# Altium schematic sheet USB to UART controller.SchDoc
size A4; SheetNumber: 5; SheetTotal: 7
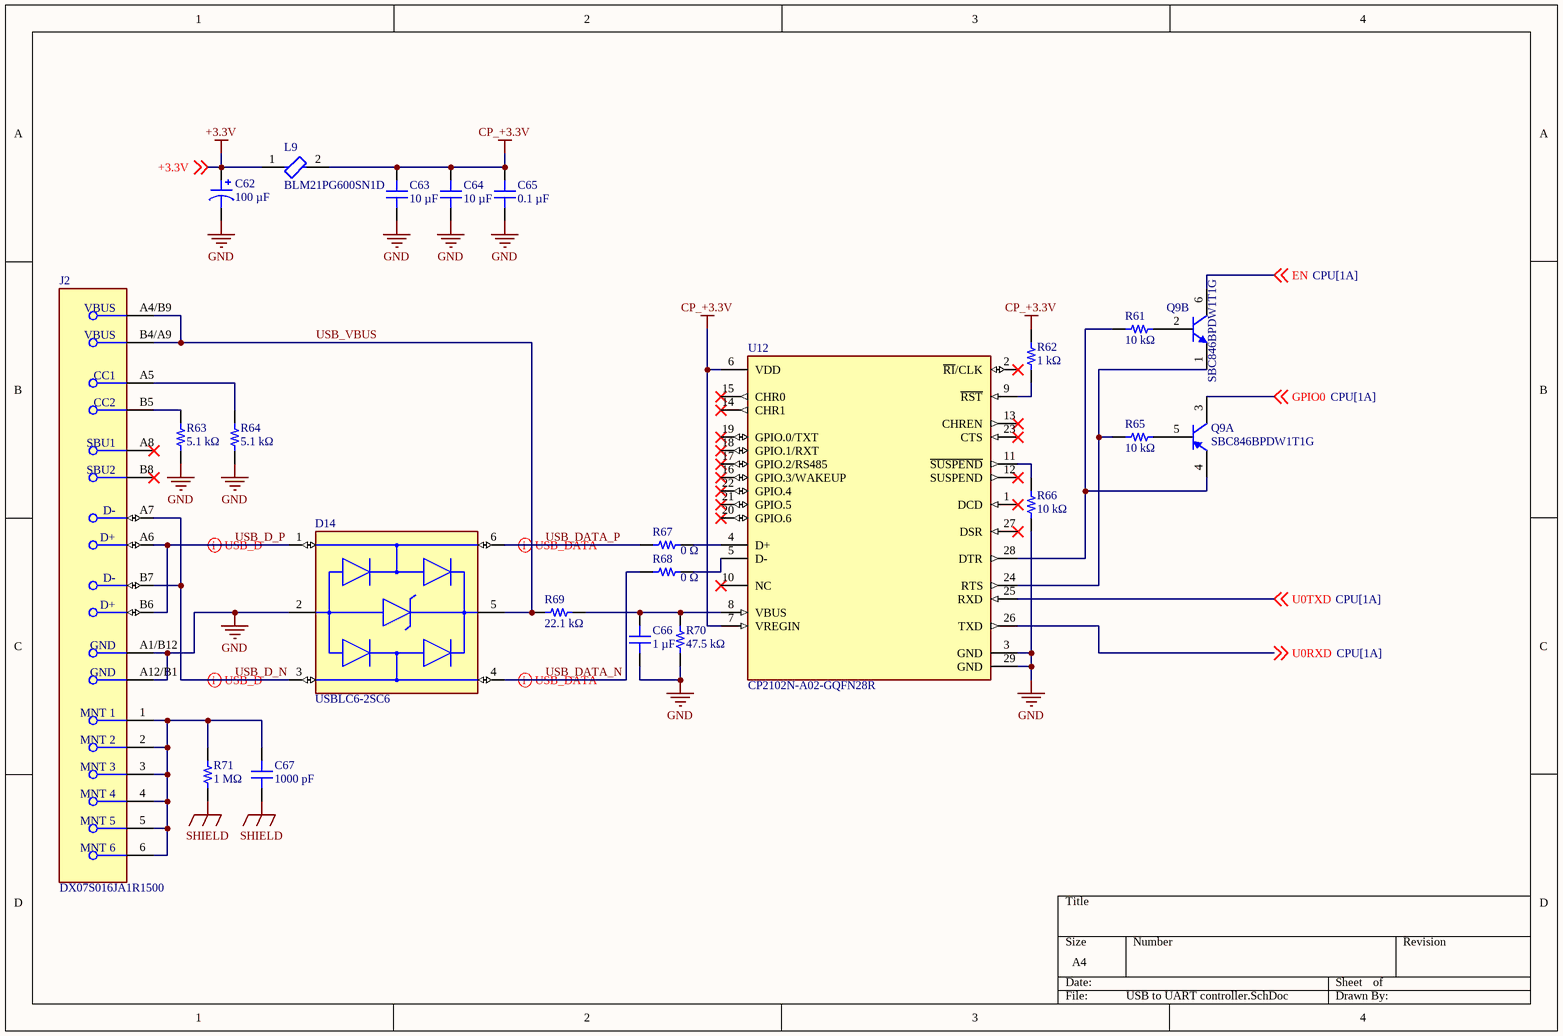
[diagram p0: USB to UART controller.SchDoc]

## Parts
C62  100 µF  [CAP POL 1411_3528]
C63  10 µF  [CAP 0805_2012]
C64  10 µF  [CAP 0805_2012]
C65  0.1 µF  [CAP 0603_1608]
C66  1 µF  [CAP 0805_2012]
C67  1000 pF  [CAP 1210_3225 - 1MM]
D14  USBLC6-2SC6  [FP-SOT-666-MFG]
J2  DX07S016JA1R1500  [FP-DX07S016JA1R1500-MFG]
L9  BLM21PG600SN1D  [FP-BLM21-0_2-t0_85-e0_5-d-IPC_A]
Q9  SBC846BPDW1T1G  [ONSC-SOT-363-6-419B-02_V]  (parts A,B of 2)
R61  10 kΩ  [RES 0603_1608]
R62  1 kΩ  [RES 0603_1608]
R63  5.1 kΩ  [RES 0603_1608]
R64  5.1 kΩ  [RES 0603_1608]
R65  10 kΩ  [RES 0603_1608]
R66  10 kΩ  [RES 0603_1608]
R67  0 Ω  [RES 0603_1608]
R68  0 Ω  [RES 0603_1608]
R69  22.1 kΩ  [RES 0603_1608]
R70  47.5 kΩ  [RES 0603_1608]
R71  1 MΩ  [RES 0805_2012]
U12  CP2102N-A02-GQFN28R  [FP-CP2102N-A02-GQFN28R-MFG]

## Nets
+3.3V: C62.1 L9.1 ; off-sheet +3.3V
CP_+3.3V: C63.2 C64.2 C65.2 L9.2 R62.2 U12.6(VDD) U12.7(VREGIN)
GND: C62.2 C63.1 C64.1 C65.1 C66.1 D14.2(GND) J2.A1/B12(GND) J2.A12/B1(GND) R63.1 R64.1 R66.1 R70.1 U12.3(GND) U12.29(GND)
SHIELD: C67.1 R71.1
EN: Q9.6(C) ; off-sheet EN
GPIO0: Q9.3(C) ; off-sheet GPIO0
U0RXD: U12.26(TXD) ; off-sheet U0RXD
U0TXD: U12.25(RXD) ; off-sheet U0TXD
USB_D_N: D14.3(I/O2) J2.A7(D-) J2.B7(D-)
USB_D_P: D14.1(I/O1) J2.A6(D+) J2.B6(D+)
USB_DATA_N: D14.4(I/O2) R68.1
USB_DATA_P: D14.6(I/O1) R67.1
USB_VBUS: D14.5(VBUS) J2.A4/B9(VBUS) J2.B4/A9(VBUS) R69.2
NetC66_2: C66.2 R69.1 R70.2 U12.8(VBUS)
NetC67_2: C67.2 J2.1(MNT_1) J2.2(MNT_2) J2.3(MNT_3) J2.4(MNT_4) J2.5(MNT_5) J2.6(MNT_6) R71.2
NetJ2_A5: J2.A5(CC1) R64.2
NetJ2_B5: J2.B5(CC2) R63.2
NetQ9_1: Q9.1(E) R65.2 U12.24(RTS)
NetQ9_2: Q9.2(B) R61.1
NetQ9_4: Q9.4(E) R61.2 U12.28(DTR)
NetQ9_5: Q9.5(B) R65.1
NetR62_1: R62.1 U12.9(~{RST})
NetR66_2: R66.2 U12.11(~{SUSPEND})
NetR67_2: R67.2 U12.4(D+)
NetR68_2: R68.2 U12.5(D-)

Not connected (* = marked no-connect by the designer): J2 A8(SBU1)* B8(SBU2)*; U12 1(DCD)* 2(~{RI}/CLK)* 10(NC)* 12(SUSPEND)* 13(CHREN)* 14(CHR1)* 15(CHR0)* 16(GPIO.3/WAKEUP)* 17(GPIO.2/RS485)* 18(GPIO.1/RXT)* 19(GPIO.0/TXT)* 20(GPIO.6)* 21(GPIO.5)* 22(GPIO.4)* 23(CTS)* 27(DSR)*

## Layout directives
differential pair: USB_D_N, USB_D_P, USB_DATA_N, USB_DATA_P

## Library data of the parts
C62 = T494B107M006AT: CAP TANT 100UF 20% 6.3V 1411; manufacturer: KEMET; Manufacturer Size Code: B; ESR (Equivalent Series Resistance): 1.5Ohm; Lifetime @ Temp.: 2000 Hrs @ 125°C; Type: Molded; Part Number: T494B107M006AT; Value: 100 µF; Capacitance: 100 µF; componentlink1description: Datasheet; componentlink1url: https://api.kemet.com/component-edge/download/datasheet/T494B107M006AT.pdf; componentlink2description: DigiKey Link; componentlink2url: https://www.digikey.com/en/products/detail/kemet/T494B107M006AT/818693; Device Package: 1411 (3528 Metric); Features: General Purpose; Height - Seated (Max): 0.083" (2.10mm); lastupdated: 3.06.2024 19:29:03; Lifecycle Status: Active; Minimum Order: 1; Mounting Type: Surface Mount; Operating Temperature: -55°C ~ 125°C; Package / Case: 1411 (3528 Metric); packaging: TapeAndReel; partid: 7; Part Status: Active; price: 0.49; series: T494; Size / Dimension: 0.138" L x 0.110" W (3.50mm x 2.80mm); Supplier 1: DigiKey; Supplier Part Number 1: 399-3833-1-ND; Tolerance: ±20%; Voltage - Rated: 6.3 V
C63 C64 = CGA4J1X7R0J106K125AC: CAP CER 10UF 6.3V X7R 0805; manufacturer: TDK Corporation; Tolerance: ±10%; Part Number: CGA4J1X7R0J106K125AC; Capacitance: 10 µF; Applications: Automotive; componentlink1description: Datasheet; componentlink1url: https://product.tdk.com/info/en/catalog/datasheets/mlcc_automotive_general_en.pdf?ref_disty=digikey; componentlink2description: DigiKey Link; componentlink2url: https://www.digikey.com/en/products/detail/tdk-corporation/CGA4J1X7R0J106K125AC/2672864; Device Package: 0805 (2012 Metric); lastupdated: 9.02.2024 20:16:07; Lifecycle Status: Active; Minimum Order: 1; Mounting Type: Surface Mount, MLCC; Operating Temperature: -55°C ~ 125°C; Package / Case: 0805 (2012 Metric); packaging: TapeAndReel; partid: 3016; Part Status: Active; price: 0.06; Ratings: AEC-Q200; series: CGA; Size / Dimension: 0.079" L x 0.049" W (2.00mm x 1.25mm); Supplier 1: DigiKey; Supplier Part Number 1: 445-6971-1-ND; Temperature Coefficient: X7R; Thickness (Max): 0.057" (1.45mm); value: 10 µF; Voltage - Rated: 6.3V
C65 = C1608X7R1H104K080AE: CAP CER 0.1UF 50V X7R 0603; manufacturer: TDK Corporation; Tolerance: ±10%; Part Number: C1608X7R1H104K080AE; Capacitance: 0.1 µF; Applications: Boardflex Sensitive; componentlink1description: Datasheet; componentlink1url: https://product.tdk.com/info/en/catalog/datasheets/mlcc_commercial_soft_en.pdf?ref_disty=digikey; componentlink2description: DigiKey Link; componentlink2url: https://www.digikey.com/en/products/detail/tdk-corporation/C1608X7R1H104K080AE/4490564; Device Package: 0603 (1608 Metric); Features: Soft Termination; lastupdated: 9.02.2024 20:10:17; Lifecycle Status: Active; Minimum Order: 1; Mounting Type: Surface Mount, MLCC; Operating Temperature: -55°C ~ 125°C; Package / Case: 0603 (1608 Metric); packaging: TapeAndReel; partid: 12789; Part Status: Active; price: 0.02; series: C; Size / Dimension: 0.063" L x 0.031" W (1.60mm x 0.80mm); Supplier 1: DigiKey; Supplier Part Number 1: 445-15927-6-ND; Temperature Coefficient: X7R; Thickness (Max): 0.037" (0.95mm); value: 0.1 µF; Voltage - Rated: 50V
C66 = C2012X7R1E105K125AB: CAP CER 1UF 25V X7R 0805; manufacturer: TDK Corporation; Tolerance: ±10%; Part Number: C2012X7R1E105K125AB; Capacitance: 1 µF; Applications: General Purpose; componentlink1description: Datasheet; componentlink1url: https://product.tdk.com/info/en/catalog/datasheets/mlcc_commercial_general_en.pdf?ref_disty=digikey; componentlink2description: DigiKey Link; componentlink2url: https://www.digikey.com/en/products/detail/tdk-corporation/C2012X7R1E105K125AB/513887; Device Package: 0805 (2012 Metric); Features: Low ESL; lastupdated: 9.02.2024 20:15:16; Lifecycle Status: Active; Minimum Order: 1; Mounting Type: Surface Mount, MLCC; Operating Temperature: -55°C ~ 125°C; Package / Case: 0805 (2012 Metric); packaging: TapeAndReel; partid: 33961; Part Status: Active; price: 0.03; series: C; Size / Dimension: 0.079" L x 0.049" W (2.00mm x 1.25mm); Supplier 1: DigiKey; Supplier Part Number 1: 445-1354-1-ND; Temperature Coefficient: X7R; Thickness (Max): 0.057" (1.45mm); value: 1 µF; Voltage - Rated: 25V
C67 = KGM32LCG3D102JU: CAP CER 1000PF 2KV C0G/NP0 1210; manufacturer: KYOCERA AVX; Temperature Coefficient: C0G, NP0; Tolerance: ±5%; Voltage - Rated: 2000V (2kV); Part Number: KGM32LCG3D102JU; Value: 1000 pF; Applications: General Purpose; Capacitance: 1000 pF; componentlink1description: Datasheet; componentlink1url: https://datasheets.kyocera-avx.com/HVKGM.pdf; componentlink2description: DigiKey Link; componentlink2url: https://www.digikey.com/en/products/detail/kyocera-avx/KGM32LCG3D102JU/11249117; Device Package: 1210 (3225 Metric); Features: High Voltage; lastupdated: 4.06.2024 19:20:42; Lifecycle Status: Active; Minimum Order: 1; Mounting Type: Surface Mount, MLCC; Operating Temperature: -55°C ~ 125°C; Package / Case: 1210 (3225 Metric); packaging: TapeAndReel; partid: 58470; price: 0.32; series: KGM - HV; Size / Dimension: 0.130" L x 0.098" W (3.30mm x 2.50mm); Supplier 1: DigiKey; Supplier Part Number 1: 478-KGM32LCG3D102JUCT-ND; Thickness (Max): 0.110" (2.80mm)
D14 = CMP-12225-000058-1: TVS DIODE 5.25V 17V SOT666; Manufacturer: STMicroelectronics; Min Breakdown Voltage: 6V; Power Line Protection: Yes; Element Configuration: Dual; Test Current: 1mA; Working Voltage: 5V; Number of Channels: 2; Max Reverse Leakage Current: 150nA; Direction: Unidirectional; Peak Pulse Current: 5A; Number of Elements: 1; Capacitance: 3.5pF; Value: 2.5pF; Data Rate: 480Mbps; Forward Voltage: 1.1V; Max Junction Temperature (Tj): 125°C; Max Breakdown Voltage: 6V; Height: 0.6mm; Depth: 1.3mm; Contact Plating: Tin; Reverse Breakdown Voltage: 6V; REACH SVHC: No SVHC; Operating Supply Voltage: 5V; Width: 1.3mm; Max Operating Temperature: 125°C; Reverse Standoff Voltage: 5V; ESD Protection: Yes; Package Quantity: 1; Termination: SMD/SMT; Length: 1.7mm; Leakage Current: 150nA; Number of Bidirectional Channels: 2; Case/Package: SOT-666; Min Operating Temperature: -40°C; Number of Pins: 6; Clamping Voltage: 17V; Breakdown Voltage: 6V; Lead Free: Lead Free; Radiation Hardening: No; Packaging: Tape and Reel; Mount: Surface Mount; Polarity: Unidirectional; Supplier: TME; Supplier Part Number: USBLC6-2SC6; Manufacturer Part Number: USBLC6-2SC6; RoHS: Compliant; Category: TVS Diodes; Stock: 48156; China RoHS: Compliant; Lifecycle Status: Production; Max Repetitive Reverse Voltage (Vrrm): 5.25V; Mounting Technology: Surface Mount; Pins: 6; Number of Terminals: 6; Peak Reverse Current: 150nA; Schedule B: 8536300000, 8536300000|8536300000|8536300000|8536300000|8536300000|8536300000|8536300000|8536300000|8536300000|8536300000|8536300000|8536300000|8536300000|8536300000|8536300000|8536300000|8536300000|8536300000|8536300000|8536300000|8536300000|8536300000|8536300000|85; ComponentLink1URL: https://datasheet.octopart.com:443/USBLC6-2SC6-STMicroelectronics-datasheet-10412581.pdf?src-supplier=Newark; ComponentLink1Description: https://datasheet.octopart.com:443/USBLC6-2SC6-STMicroelectronics-datasheet-10412581.pdf?src-supplier=Newark; ComponentLink2URL: https://datasheet.octopart.com:443/USBLC6-2SC6-STMicroelectronics-datasheet-181961833.pdf?src-supplier=Newark; ComponentLink2Description: https://datasheet.octopart.com:443/USBLC6-2SC6-STMicroelectronics-datasheet-181961833.pdf?src-supplier=Newark; ComponentLink3URL: https://datasheet.octopart.com:443/USBLC6-2SC6-STMicroelectronics-datasheet-525477.pdf?src-supplier=Factory+Futures; ComponentLink3Description: https://datasheet.octopart.com:443/USBLC6-2SC6-STMicroelectronics-datasheet-525477.pdf?src-supplier=Factory+Futures; ComponentLink4URL: https://datasheet.octopart.com:443/USBLC6-2SC6-STMicroelectronics-datasheet-82998616.pdf?src-supplier=Farnell; ComponentLink4Description: https://datasheet.octopart.com:443/USBLC6-2SC6-STMicroelectronics-datasheet-82998616.pdf?src-supplier=Farnell; ComponentLink5URL: https://datasheet.octopart.com:443/USBLC6-2SC6-STMicroelectronics-datasheet-46285.pdf?src-supplier=Farnell; ComponentLink5Description: https://datasheet.octopart.com:443/USBLC6-2SC6-STMicroelectronics-datasheet-46285.pdf?src-supplier=Farnell; ComponentLink6URL: https://datasheet.octopart.com:443/USBLC6-2SC6-STMicroelectronics-datasheet-14050643.pdf?src-supplier=iiiC; ComponentLink6Description: https://datasheet.octopart.com:443/USBLC6-2SC6-STMicroelectronics-datasheet-14050643.pdf?src-supplier=iiiC; ComponentLink7URL: https://datasheet.octopart.com:443/USBLC6-2SC6-STMicroelectronics-datasheet-10521292.pdf?src-supplier=Jameco; ComponentLink7Description: https://datasheet.octopart.com:443/USBLC6-2SC6-STMicroelectronics-datasheet-10521292.pdf?src-supplier=Jameco
J2 = CMP-19038-000003-1: CONN RCP USB2.0 TYP C 24P SMD RA
L9 = CMP-0686-00616-3: Chip Ferrite Bead, 0805, 60Ω @ 100MHz, 0.02Ω, 25%, 3.5A; DC Resistance-Max: 20mR; Number of Circuits: 1; Impedance: 60R; DC Current: 3A; Shielding: Unshielded; Material: Steel; Military Standard: Not; DC Resistance (DCR): 20mR; Core Material: Ferrite; Termination: SMD/SMT; Max Operating Temperature: 125°C; Max Current Rating: 3.5A; Length: 2mm; Packaging: Tape and Reel; Case Code (Metric): 2012; Series: BLM21P; REACH SVHC: No SVHC; Width: 1.25mm; Current Rating: 3.5A; Height: 0.85mm; RoHS Compliant: Yes; Case Code (Imperial): 0805; Radiation Hardening: No; Frequency: 100MHz; Package Quantity: 1; Depth: 1.25mm; Tolerance: 25%; Number of Lines: 1; Lead Free: Lead Free; Case/Package: 0805; Min Operating Temperature: -55°C; Max DC Current: 3A; Number of Pins: 2; Test Frequency: 100MHz
Q9 = CMP-1048-00842-1: Dual General Purpose Transistors, NPN / PNP (Complementary), 6-Pin SOT-363, Pb-Free, Tape and Reel; Manufacturer: On Semiconductor; IC Continuous (A): 0.1; fT Min (MHz): 100; ComponentLink2Description: Datasheet; RoHS: TRUE; ComponentLink2URL: http://www.onsemi.cn/pub_link/Collateral/BC846BPDW1T1-D.PDF; ComponentLink1Description: Manufacturer URL; ComponentLink1URL: http://www.onsemi.com/; Mounting Technology: Surface Mount; PackageVersion: Rev. Y, 12/2012; Packing: Tape and Reel; Polarity: Complementary; ComponentLink3URL: http://www.onsemi.cn/pub_link/Collateral/419B-02.PDF; DatasheetVersion: Rev. 9; PackageDescription: 6-Pin Small Outline Transistor, Body 2 x 1.25 mm, Pitch 0.65 mm; ComponentLink3Description: Package Specification; PartNumber: SBC846BPDW1T1G; PackageReference: SOT-363-6-419B-02
R61 R65 R66 = CRCW060310K0FKEA: RES SMD 10K OHM 1% 1/10W 0603; Manufacturer: Vishay Dale; Power (Watts): 0.1W, 1/10W; Resistance: 10 kOhms; Temperature Coefficient: ±100ppm/°C; Part Number: CRCW060310K0FKEA; Value: 10 kΩ; ComponentLink1Description: Datasheet; ComponentLink1URL: http://www.vishay.com/docs/20035/dcrcwe3.pdf; ComponentLink2Description: DigiKey Link; ComponentLink2URL: https://www.digikey.com/en/products/detail/vishay-dale/CRCW060310K0FKEA/1174782; Composition: Thick Film; Device Package: 0603 (1608 Metric); Features: Automotive AEC-Q200; Height - Seated (Max): 0.020" (0.50mm); LastUpdated: 9.02.2024 20:42:10; Lifecycle Status: Active; Minimum Order: 1; Number of Terminations: 2; Operating Temperature: -55°C ~ 155°C; Package / Case: 0603 (1608 Metric); Packaging: CutTape; PartId: 24636; Part Status: Active; Price: 0.01; Ratings: AEC-Q200; Series: CRCW; Size / Dimension: 0.061" L x 0.033" W (1.55mm x 0.85mm); Supplier 1: DigiKey; Supplier Part Number 1: 541-10.0KHCT-ND; Supplier Device Package: 0603; Tolerance: ±1%
R62 = CRCW06031K00FKEA: RES SMD 1K OHM 1% 1/10W 0603; Manufacturer: Vishay Dale; Power (Watts): 0.1W, 1/10W; Resistance: 1 kOhms; Temperature Coefficient: ±100ppm/°C; Part Number: CRCW06031K00FKEA; Value: 1 kΩ; ComponentLink1Description: Datasheet; ComponentLink1URL: http://www.vishay.com/docs/20035/dcrcwe3.pdf; ComponentLink2Description: DigiKey Link; ComponentLink2URL: https://www.digikey.com/en/products/detail/vishay-dale/CRCW06031K00FKEA/1174668; Composition: Thick Film; Device Package: 0603 (1608 Metric); Features: Automotive AEC-Q200; Height - Seated (Max): 0.020" (0.50mm); LastUpdated: 9.02.2024 20:42:10; Lifecycle Status: Active; Minimum Order: 1; Number of Terminations: 2; Operating Temperature: -55°C ~ 155°C; Package / Case: 0603 (1608 Metric); Packaging: CutTape; PartId: 24637; Part Status: Active; Price: 0.01; Ratings: AEC-Q200; Series: CRCW; Size / Dimension: 0.061" L x 0.033" W (1.55mm x 0.85mm); Supplier 1: DigiKey; Supplier Part Number 1: 541-1.00KHCT-ND; Supplier Device Package: 0603; Tolerance: ±1%
R63 R64 = CRCW06035K10FKEA: RES SMD 5.1K OHM 1% 1/10W 0603; Manufacturer: Vishay Dale; Power (Watts): 0.1W, 1/10W; Temperature Coefficient: ±100ppm/°C; Part Number: CRCW06035K10FKEA; Value: 5.1 kΩ; ComponentLink1Description: Datasheet; ComponentLink1URL: http://www.vishay.com/docs/20035/dcrcwe3.pdf; ComponentLink2Description: DigiKey Link; ComponentLink2URL: https://www.digikey.com/en/products/detail/vishay-dale/CRCW06035K10FKEA/1174748; Composition: Thick Film; Device Package: 0603 (1608 Metric); Features: Automotive AEC-Q200; Height - Seated (Max): 0.020" (0.50mm); LastUpdated: 9.02.2024 20:43:06; Lifecycle Status: Active; Minimum Order: 1; Number of Terminations: 2; Operating Temperature: -55°C ~ 155°C; Package / Case: 0603 (1608 Metric); Packaging: CutTape; PartId: 12590; Part Status: Active; Price: 0.01; Ratings: AEC-Q200; Resistance: 5.1 kΩ; Series: CRCW; Size / Dimension: 0.061" L x 0.033" W (1.55mm x 0.85mm); Supplier 1: DigiKey; Supplier Part Number 1: 541-5.10KHCT-ND; Supplier Device Package: 0603; Tolerance: ±1%
R67 R68 = ERJ-3GEY0R00V: RES SMD 0 OHM JUMPER 1/10W 0603; Manufacturer: Panasonic Electronic Components; Power (Watts): 0.1W, 1/10W; Part Number: ERJ-3GEY0R00V; Value: 0 Ω; ComponentLink1Description: Datasheet; ComponentLink1URL: http://industrial.panasonic.com/www-cgi/jvcr13pz.cgi?E+PZ+3+AOA0001+ERJ3GEY0R00V+7+WW; ComponentLink2Description: DigiKey Link; ComponentLink2URL: https://www.digikey.com/en/products/detail/panasonic-electronic-components/ERJ-3GEY0R00V/135656; Composition: Thick Film; Device Package: 0603 (1608 Metric); Features: Automotive AEC-Q200; Height - Seated (Max): 0.022" (0.55mm); LastUpdated: 9.02.2024 20:42:26; Lifecycle Status: Active; Minimum Order: 1; Number of Terminations: 2; Operating Temperature: -55°C ~ 155°C; Package / Case: 0603 (1608 Metric); Packaging: CutTape; PartId: 22603; Part Status: Active; Price: 0.01; Ratings: AEC-Q200; Resistance: 0 Ω; Series: ERJ-3G; Size / Dimension: 0.063" L x 0.031" W (1.60mm x 0.80mm); Supplier 1: DigiKey; Supplier Part Number 1: P0.0GCT-ND; Supplier Device Package: 0603; Tolerance: Jumper
R69 = CRCW060322K1FKEA: RES SMD 22.1K OHM 1% 1/10W 0603; Manufacturer: Vishay Dale; Power (Watts): 0.1W, 1/10W; Temperature Coefficient: ±100ppm/°C; Part Number: CRCW060322K1FKEA; Value: 22.1 kΩ; ComponentLink1Description: Datasheet; ComponentLink1URL: http://www.vishay.com/docs/20035/dcrcwe3.pdf; ComponentLink2Description: DigiKey Link; ComponentLink2URL: https://www.digikey.com/en/products/detail/vishay-dale/CRCW060322K1FKEA/1174819; Composition: Thick Film; Device Package: 0603 (1608 Metric); Features: Automotive AEC-Q200; Height - Seated (Max): 0.020" (0.50mm); LastUpdated: 9.02.2024 20:43:05; Lifecycle Status: Active; Minimum Order: 1; Number of Terminations: 2; Operating Temperature: -55°C ~ 155°C; Package / Case: 0603 (1608 Metric); Packaging: CutTape; PartId: 12700; Part Status: Active; Price: 0.01; Ratings: AEC-Q200; Resistance: 22.1 kΩ; Series: CRCW; Size / Dimension: 0.061" L x 0.033" W (1.55mm x 0.85mm); Supplier 1: DigiKey; Supplier Part Number 1: 541-22.1KHCT-ND; Supplier Device Package: 0603; Tolerance: ±1%
R70 = CRCW060347K5FKEA: RES SMD 47.5K OHM 1% 1/10W 0603; Manufacturer: Vishay Dale; Power (Watts): 0.1W, 1/10W; Temperature Coefficient: ±100ppm/°C; Part Number: CRCW060347K5FKEA; Value: 47.5 kΩ; ComponentLink1Description: Datasheet; ComponentLink1URL: http://www.vishay.com/docs/20035/dcrcwe3.pdf; ComponentLink2Description: DigiKey Link; ComponentLink2URL: https://www.digikey.com/en/products/detail/vishay-dale/CRCW060347K5FKEA/1174859; Composition: Thick Film; Device Package: 0603 (1608 Metric); Features: Automotive AEC-Q200; Height - Seated (Max): 0.020" (0.50mm); LastUpdated: 9.02.2024 20:43:05; Lifecycle Status: Active; Minimum Order: 1; Number of Terminations: 2; Operating Temperature: -55°C ~ 155°C; Package / Case: 0603 (1608 Metric); Packaging: TapeAndReel; PartId: 12602; Part Status: Active; Price: 0.01; Ratings: AEC-Q200; Resistance: 47.5 kΩ; Series: CRCW; Size / Dimension: 0.061" L x 0.033" W (1.55mm x 0.85mm); Supplier 1: DigiKey; Supplier Part Number 1: 541-47.5KHCT-ND; Supplier Device Package: 0603; Tolerance: ±1%
R71 = RCS08051M00FKEA: RES SMD 1M OHM 1% 1/2W 0805; Manufacturer: Vishay Dale; Power (Watts): 0.5W, 1/2W; Temperature Coefficient: ±100ppm/°C; Part Number: RCS08051M00FKEA; Value: 1 MΩ; ComponentLink1Description: Datasheet; ComponentLink1URL: http://www.vishay.com/docs/20065/rcse3.pdf; ComponentLink2Description: DigiKey Link; ComponentLink2URL: https://www.digikey.com/en/products/detail/vishay-dale/RCS08051M00FKEA/5866999; Composition: Thick Film; Device Package: 0805 (2012 Metric); Features: Automotive AEC-Q200, Pulse Withstanding; Height - Seated (Max): 0.020" (0.50mm); LastUpdated: 8.02.2024 21:02:38; Lifecycle Status: Active; Minimum Order: 1; Number of Terminations: 2; Operating Temperature: -55°C ~ 155°C; Package / Case: 0805 (2012 Metric); Packaging: TapeAndReel; PartId: 27791; Part Status: Active; Price: 0.02; Ratings: AEC-Q200; Resistance: 1 MΩ; Series: RCS e3; Size / Dimension: 0.079" L x 0.049" W (2.00mm x 1.25mm); Supplier 1: DigiKey; Supplier Part Number 1: 541-2853-1-ND; Supplier Device Package: 0805; Tolerance: ±1%
U12 = CMP-08093-000007-1: IC USB TO UART BRIDGE QFN28